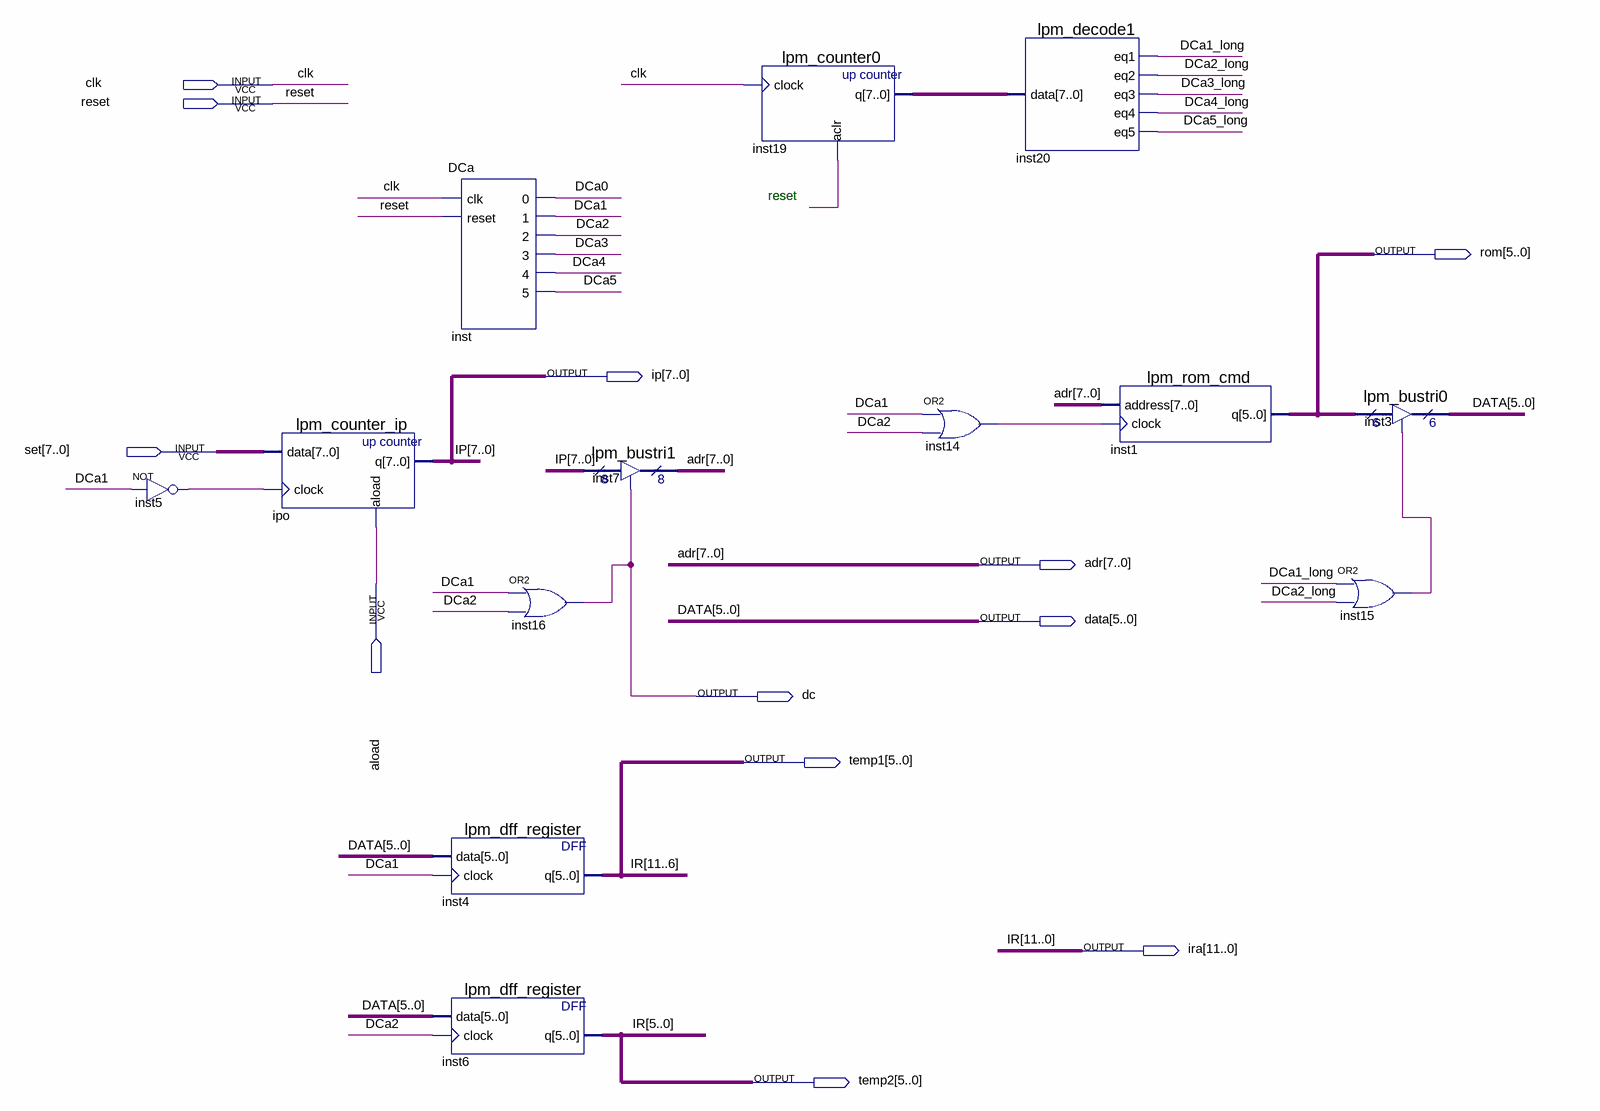
[diagram p0: schematic sheet]
// Quartus schematic test.bdf as structural Verilog: 13 symbols, 12 pins
module test (
  input  clk,
  input  reset,
  input  [7:0] set,
  input  aload,
  output [5:0] rom,
  output [7:0] ip,
  output [7:0] adr,
  output [5:0] data,
  output dc,
  output [5:0] temp1,
  output [11:0] ira,
  output [5:0] temp2
);

  wire DCa0, DCa1, DCa1_long, DCa2, DCa2_long, DCa3, DCa3_long, DCa4, DCa4_long, DCa5, DCa5_long, inst5_out,
       inst14_out, inst15_out;
  wire [7:0] inst19_q;

  not inst5 (inst5_out, DCa1);
  lpm_counter_ip ipo (.data(set), .clock(inst5_out), .aload(aload), .q(ip));
  DCa inst (.clk(clk), .reset(reset), .\0 (DCa0), .\1 (DCa1), .\2 (DCa2), .\3 (DCa3), .\4 (DCa4), .\5 (DCa5));
  lpm_dff_register inst4 (.data(data), .clock(DCa1), .q(ira[11:6]));
  lpm_dff_register inst6 (.data(data), .clock(DCa2), .q(ira[5:0]));
  or inst16 (dc, DCa1, DCa2);
  lpm_bustri1 inst7 (.enabledt(dc), .data(ip), .tridata(adr));
  lpm_counter0 inst19 (.clock(clk), .aclr(reset), .q(inst19_q));
  or inst14 (inst14_out, DCa1, DCa2);
  lpm_decode1 inst20 (
    .data(inst19_q), .eq1(DCa1_long), .eq2(DCa2_long), .eq3(DCa3_long), .eq4(DCa4_long), .eq5(DCa5_long));
  lpm_rom_cmd inst1 (.address(adr), .clock(inst14_out), .q(rom));
  or inst15 (inst15_out, DCa1_long, DCa2_long);
  lpm_bustri0 inst3 (.enabledt(inst15_out), .data(rom), .tridata(data));

  assign temp1 = ira[11:6];
  assign temp2 = ira[5:0];

  // Other names for the same wires on the sheet: IR[11:0] = ira

  // Notes on the sheet:
  //   reset
endmodule
